# Altium project Module_Tran_RF.PrjPcb
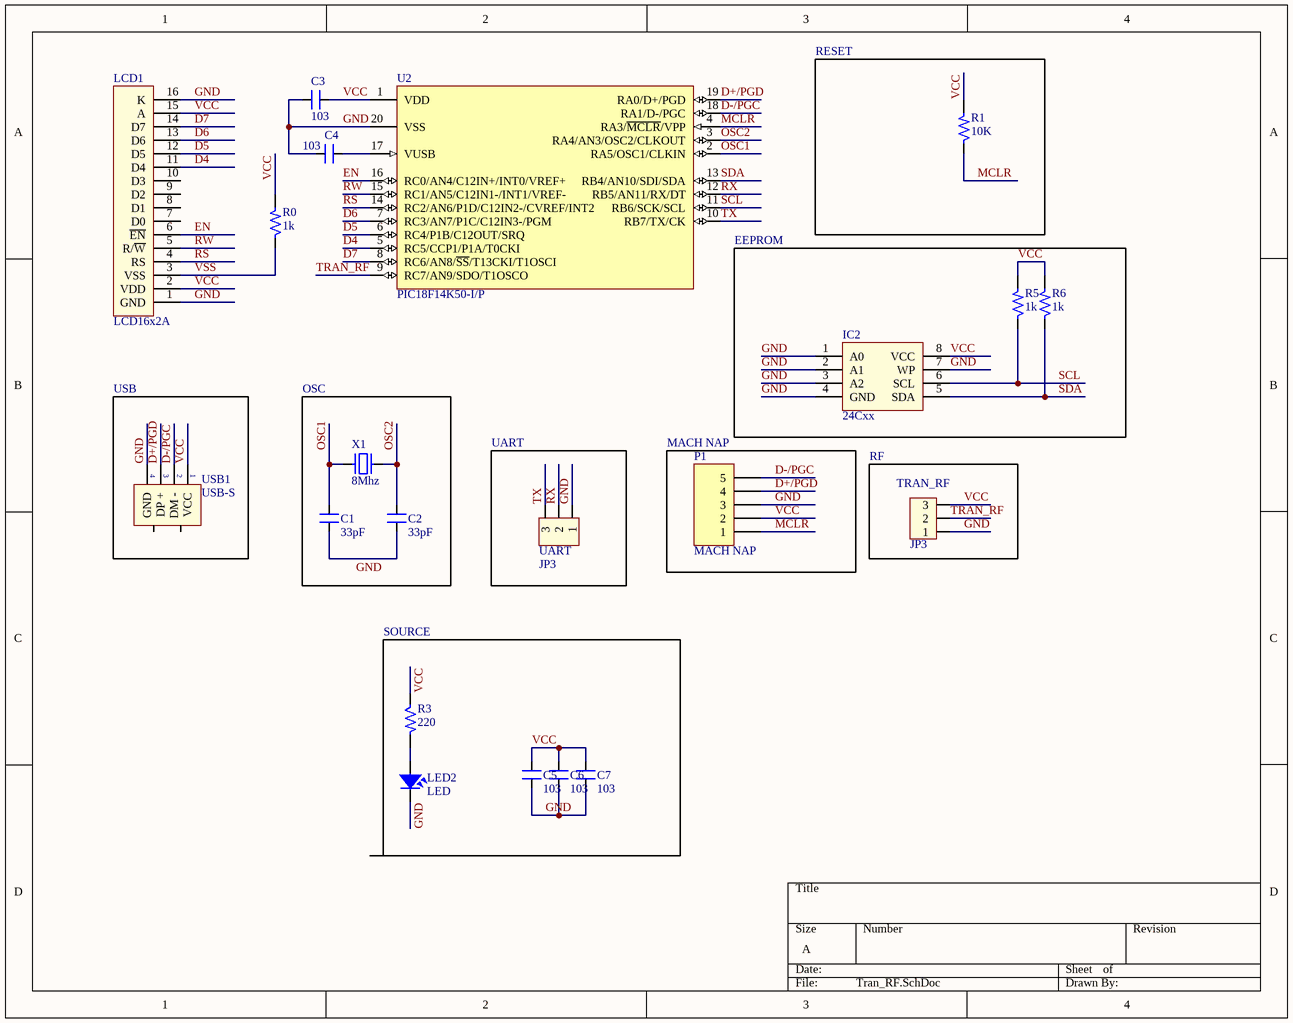
[diagram p0: Tran_RF.SchDoc]
1 sheet, 21 parts. Net scope: global (net labels, ports and power ports of the same name join across sheets).
Board file: Tran_RF.PcbDoc

## Sheet Tran_RF.SchDoc
size A

### Parts
C1  33pF  [SM-0805]
C2  33pF  [SM-0805]
C3  103  [SM-0805]
C4  103  [SM-0805]
C5  103  [SM-0805]
C6  103  [SM-0805]
C7  103  [SM-0805]
IC2  24Cxx  [SO-G8]
LCD1  LCD16x2A  [LCD]
LED2  LED  [Led-SMD]
P1  MACH NAP  [CON5]
R0  1k  [SM-1206]
R1  10K  [SM-0805]
R3  220  [SM-0805]
R5  1k  [SM-0805]
R6  1k  [SM-0805]
TRAN_RF  JP3  [CON3]
U2  PIC18F14K50-I/P  [SOP-20]
UART  JP3  [CON3]
USB1  USB-S  [USB-A-RA]
X1  8Mhz  [XT2]

### Blocks framed on the sheet
RESET: R1
EEPROM: IC2 R5 R6
USB: USB1
OSC: C1 C2 X1
UART: UART
MACH NAP: P1
RF: TRAN_RF

### Nets
D4: LCD1.11(D4) U2.5(RC5/CCP1/P1A/T0CKI)
D5: LCD1.12(D5) U2.6(RC4/P1B/C12OUT/SRQ)
D6: LCD1.13(D6) U2.7(RC3/AN7/P1C/C12IN3-/PGM)
D7: LCD1.14(D7) U2.8(RC6/AN8/~{SS}/T13CKI/T1OSCI)
D+/PGD: P1.4 U2.19(RA0/D+/PGD) USB1.3(DP_+)
D-/PGC: P1.5 U2.18(RA1/D-/PGC) USB1.2(DM_-)
EN: LCD1.6(~{EN}) U2.16(RC0/AN4/C12IN+/INT0/VREF+)
GND: C1.1 C2.1 C3.1 C4.1 C5.1 C6.1 C7.1 IC2.1(A0) IC2.2(A1) IC2.3(A2) IC2.4(GND) IC2.7(WP) LCD1.1(GND) LCD1.16(K) LED2.2 P1.3 TRAN_RF.1 U2.20(VSS) UART.1 USB1.4(GND)
MCLR: P1.1 R1.1 U2.4(RA3/~{MCLR}/VPP)
OSC1: C1.2 U2.2(RA5/OSC1/CLKIN) X1.2
OSC2: C2.2 U2.3(RA4/AN3/OSC2/CLKOUT) X1.1
RS: LCD1.4(RS) U2.14(RC2/AN6/P1D/C12IN2-/CVREF/INT2)
RW: LCD1.5(R/~{W}) U2.15(RC1/AN5/C12IN1-/INT1/VREF-)
RX: U2.12(RB5/AN11/RX/DT) UART.2
SCL: IC2.6(SCL) R5.1 U2.11(RB6/SCK/SCL)
SDA: IC2.5(SDA) R6.1 U2.13(RB4/AN10/SDI/SDA)
TRAN_RF: TRAN_RF.2 U2.9(RC7/AN9/SDO/T1OSCO)
TX: U2.10(RB7/TX/CK) UART.3
VCC: C3.2 C5.2 C6.2 C7.2 IC2.8(VCC) LCD1.2(VDD) LCD1.15(A) P1.2 R0.2 R1.2 R3.1 R5.2 R6.2 TRAN_RF.3 U2.1(VDD) USB1.1(VCC)
VSS: LCD1.3(VSS) R0.1
NetC4_2: C4.2 U2.17(VUSB)
NetLED2_1: LED2.1 R3.2

Not connected (* = marked no-connect by the designer): LCD1 7(D0) 8(D1) 9(D2) 10(D3); USB1 5 6

### Notes on the sheet
- SOURCE

### Library data of the parts
C1 C2 = CM: Cap SMD; Value: 103
C3-C7 = CM: Cap SMD; Value: 103
IC2 = 24Cxx: Standard 2-Wire Bus Interface Serial EEPROM; Value: DIP 8; Value: 24Cxx; Copyright by: VanDungEvn
LCD1 = LCD16x2: LCD dipslay 16 char, 2 line; Value: LCD16x2A
LED2 = LED: LED Single colour Green and Red; Value: LED 3 ly Single Colour
P1 = Header 5H: Header, 5-Pin, Right Angle; LatestRevisionDate: 17-Jul-2002; LatestRevisionNote: Re-released for DXP Platform.; Publisher: Altium Limited
R0 R1 R3 R5 R6 = R: Resistor 1/4W; Value: R1/4W - 1K
TRAN_RF UART = Con3: Connector 3; Value: Connector 3
U2 = PIC18F14K50-I/P: USB Flash Microcontroller with nanoWatt XLP Technology, 20-pin PDIP, Industrial Temperature; FirstPublished: 2-Dec-2009; DatasheetVersion: revC, Mar-2009; PackageVersion: revBB, Aug-2009; PackageReference: PDIP300-P20; Publisher: Altium Limited; PackageDescription: 20-Lead Plastic Dual In-Line (P) - 300 mil Body [PDIP]; Supplier 1: Digi-Key; Supplier Part Number 1: PIC18F14K50-I/P-ND; Supplier 2: Farnell; Supplier Part Number 2: 1648501; Supplier 3: Newark; Supplier Part Number 3: 77M3103; ComponentLink1Description: Datasheet; ComponentLink1URL: http://ww1.microchip.com/downloads/en/DeviceDoc/41350C.pdf; ComponentLink2Description: Packaging Specification; ComponentLink2URL: http://www.microchip.com/stellent/groups/techpub_sg/documents/packagingspec/en012702.pdf; ComponentLink3Description: Microchip.com Home; ComponentLink3URL: http://www.microchip.com/
USB1 = USB_S: USB connector; Value: USB
X1 = XT2: Crystal For all Crystal 2pin.; Value: 4Mhz